# EAGLE schematic Lichtschranke (EAGLE 9.6.2)
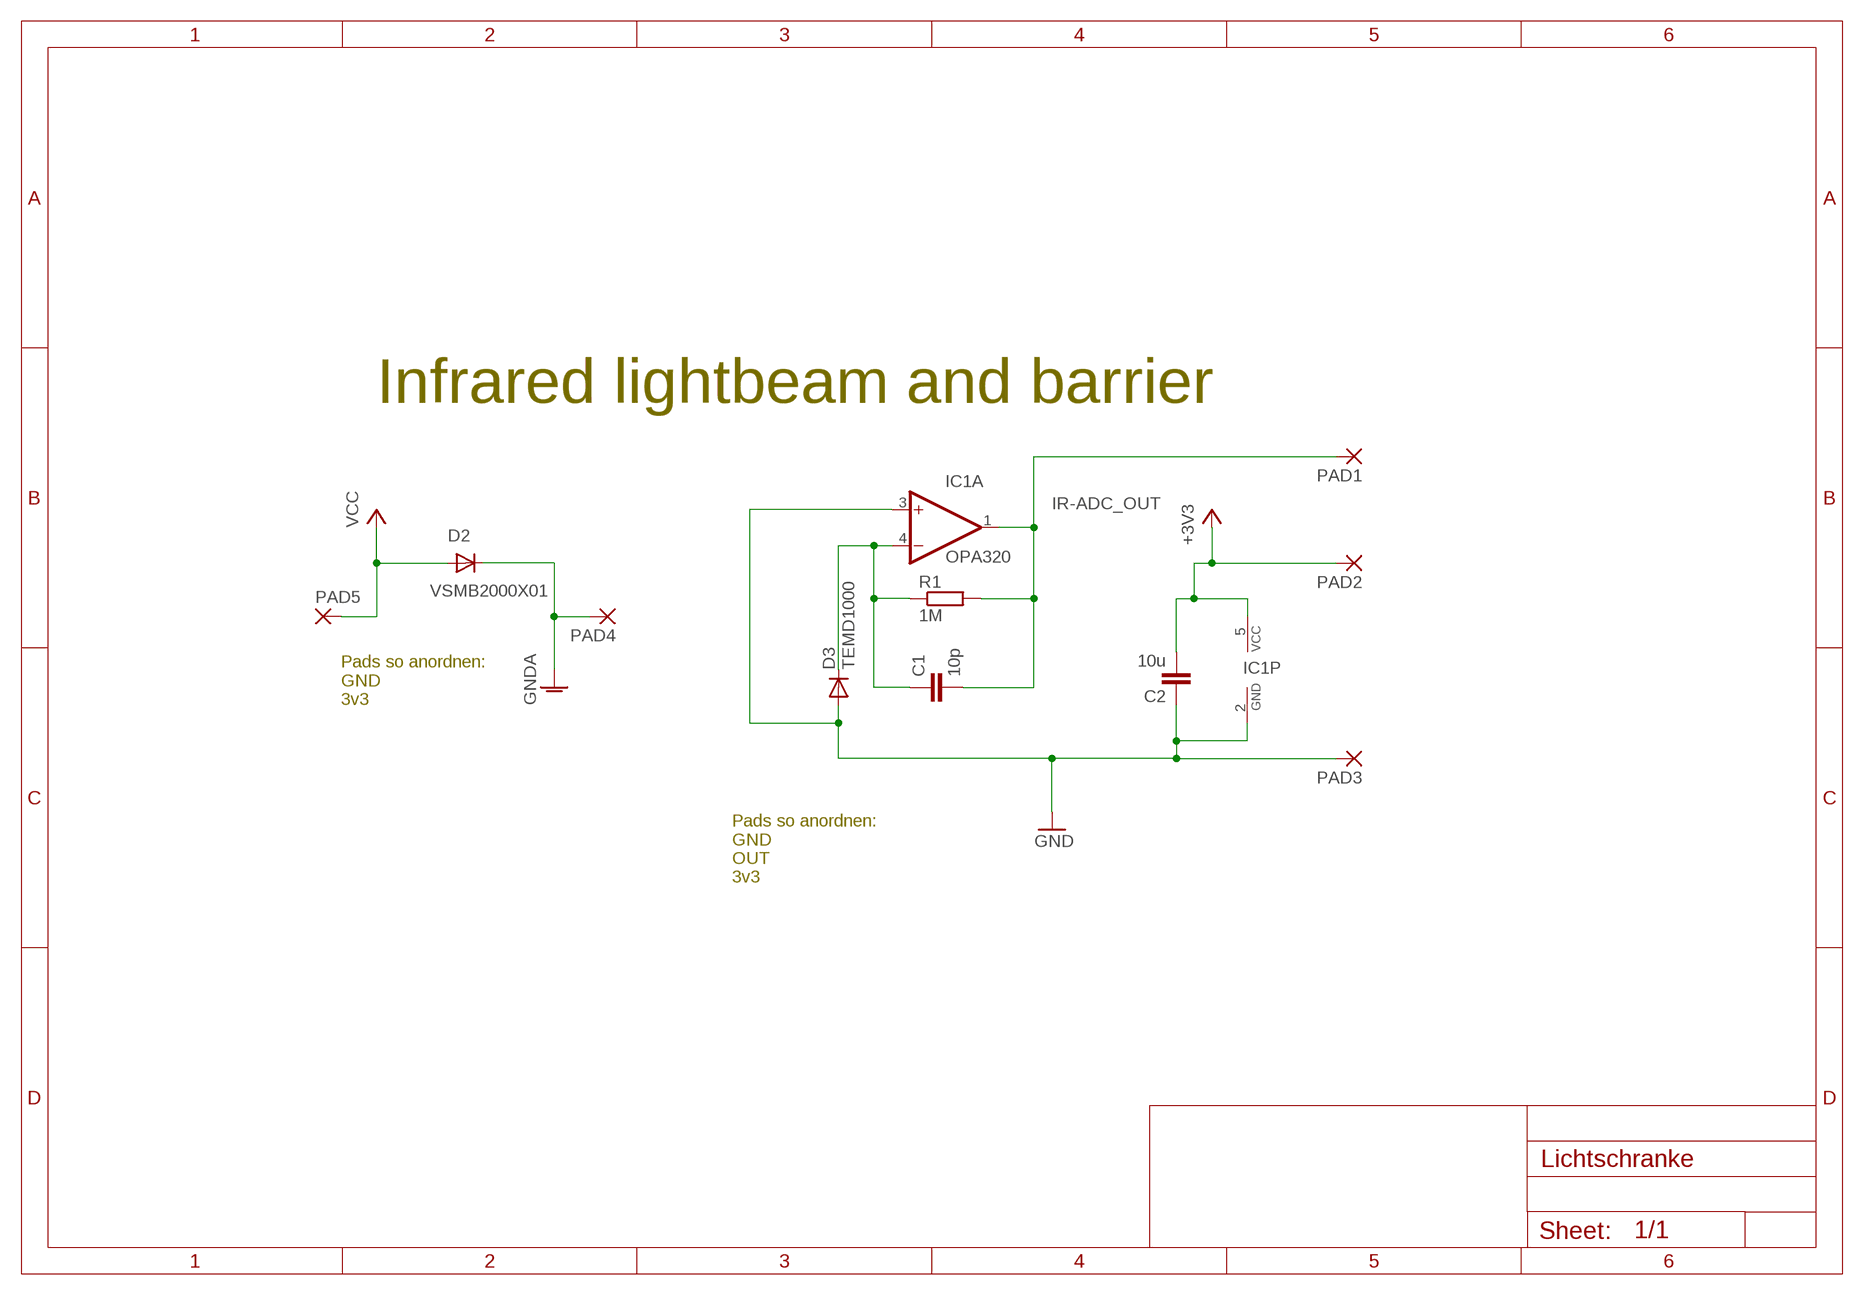
[diagram p0: schematic, sheet 1]

## Parts
C1  10p  C-EUC0603  [C0603]
C2  10u  C-EUC0603  [C0603]
D2  VSMB2000X01  DIODE  [LED-GULLR]
D3  TEMD1000  DIODE  [LED-GULLR]
IC1  OPA320  AD-OP1RT  [SOT23-5]
PAD1  SMD2  [SMD1,27-2,54]
PAD2  SMD2  [SMD1,27-2,54]
PAD3  SMD2  [SMD1,27-2,54]
PAD4  SMD2  [SMD1,27-2,54]
PAD5  SMD2  [SMD1,27-2,54]
R1  1M  R-EU_R0603  [R0603]

## Nets
+3V3: C2.2 IC1.5(P:VCC) PAD2.1(P)
GND: C2.1 D3.A IC1.2(P:GND) IC1.3(A:+IN) PAD3.1(P)
GNDA: D2.C PAD4.1(P)
IR-ADC_OUT: C1.2 IC1.1(A:OUT) PAD1.1(P) R1.2
N$62: C1.1 D3.C IC1.4(A:-IN) R1.1
VCC: D2.A PAD5.1(P)

## Notes on the sheet
- Infrared lightbeam and barrier
- Pads so anordnen:
  GND
  3v3
- Pads so anordnen:
  GND
  OUT 
  3v3

## Library data of the parts
C1 C2 = rcl:C-EU: CAPACITOR, European symbol; SPICEPREFIX: C
D2 D3 = Marvin:DIODE
IC1 = Marvin:AD-OP1
PAD1-PAD5 = wirepad:SMD2: SMD PAD
R1 = rcl:R-EU_: RESISTOR, European symbol; SPICEPREFIX: R